# Altium project QN9080_PCB_Project.PrjPCB
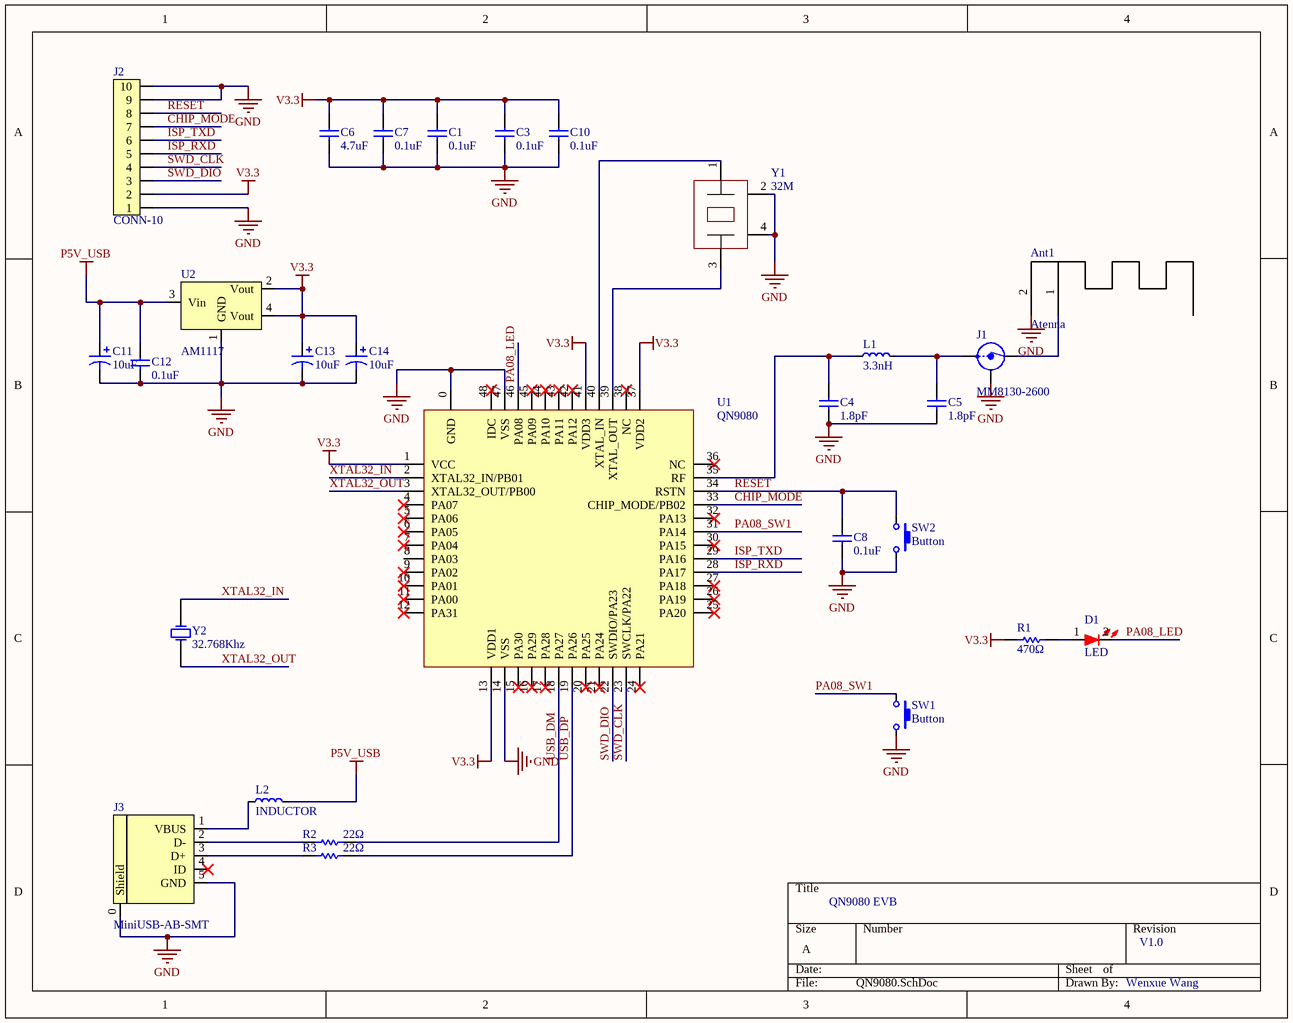
[diagram p0: QN9080.SchDoc]
1 sheet, 28 parts. Net scope: global (net labels, ports and power ports of the same name join across sheets).
Board file: QN9080.PcbDoc

## Sheet QN9080.SchDoc
size A

### Parts
Ant1  Atenna  [ANTENNA_IIFA_1]
C1  0.1uF  [RCL_0603]
C3  0.1uF  [RCL_0603]
C4  1.8pF  [RCL_0603]
C5  1.8pF  [RCL_0603]
C6  4.7uF  [RCL_0603]
C7  0.1uF  [RCL_0603]
C8  0.1uF  [RCL_0603]
C10  0.1uF  [RCL_0603]
C11  10uF  [RCL_0805]
C12  0.1uF  [RCL_0603]
C13  10uF  [RCL_0805]
C14  10uF  [RCL_0805]
D1  LED  [LED_0603]
J1  MM8130-2600  [COAXIAL-SWF]
J2  CONN-10  [HDR_1x10]
J3  MiniUSB-AB-SMT  [USB-Micro-B-RA-SMD-PiP]
L1  3.3nH  [RCL_0402]
L2  INDUCTOR  [RCL_0603]
R1  470Ω  [RCL_0603]
R2  22Ω  [RCL_0603]
R3  22Ω  [RCL_0603]
SW1  Button  [E-Switch]
SW2  Button  [E-Switch]
U1  QN9080  [QN9080QFN48pin]
U2  AM1117  [SOT-223]
Y1  32M  [BT-XTAL_2016]
Y2  32.768Khz  [XTAL32K_2012]

### Nets
GND: Ant1.2(GND) C1.1 C3.1 C4.1 C5.1 C6.1 C7.1 C8.1 C10.1 C11.2 C12.1 C13.2 C14.2 J1.2(Shield) J2.1 J2.9 J2.10 J3.0(Shield) J3.5(GND) SW1.2 SW2.2 U1.0(GND) U1.14(VSS) U1.47(VSS) U2.1(GND) Y1.2(GND) Y1.4(GND)
P5V_USB: C11.1 C12.2 L2.2 U2.3(Vin)
V3.3: C1.2 C3.2 C6.2 C7.2 C10.2 C13.1 C14.1 J2.2 R1.2 U1.1(VCC) U1.13(VDD1) U1.37(VDD2) U1.41(VDD3) U2.2(Vout) U2.4(Vout)
CHIP_MODE: J2.7 U1.33(CHIP_MODE/PB02)
ISP_RXD: J2.5 U1.28(PA17)
ISP_TXD: J2.6 U1.29(PA16)
PA08_LED: D1.2 U1.46(PA08)
PA08_SW1: SW1.1 U1.31(PA14)
RESET: C8.2 J2.8 SW2.1 U1.34(RSTN)
SWD_CLK: J2.4 U1.23(SWCLK/PA22)
SWD_DIO: J2.3 U1.22(SWDIO/PA23)
USB_DM: R2.1 U1.18(PA27)
USB_DP: R3.1 U1.19(PA26)
XTAL32_IN: U1.2(XTAL32_IN/PB01) Y2.2(OSC2)
XTAL32_OUT: U1.3(XTAL32_OUT/PB00) Y2.1(OSC1)
NetAnt1_1: Ant1.1(ANT) J1.3(OUT)
NetC4_2: C4.2 L1.1 U1.35(RF)
NetC5_2: C5.2 J1.1(IN) L1.2
NetD1_1: D1.1 R1.1
NetJ3_1: J3.1(VBUS) L2.1
NetJ3_2: J3.2(D-) R2.2
NetJ3_3: J3.3(D+) R3.2
NetU1_39: U1.39(XTAL_OUT) Y1.3(XTAL2)
NetU1_40: U1.40(XTAL_IN) Y1.1(XTAL1)

Not connected (* = marked no-connect by the designer): J3 4(ID)*; U1 4(PA07)* 5(PA06)* 6(PA05)* 7(PA04)* 8(PA03) 9(PA02)* 10(PA01)* 11(PA00)* 12(PA31)* 15(PA30)* 16(PA29)* 17(PA28)* 20(PA25)* 21(PA24)* 24(PA21)* 25(PA20)* 26(PA19)* 27(PA18)* 30(PA15)* 32(PA13)* 36(NC)* 38(NC)* 42(PA12)* 43(PA11)* 44(PA10)* 45(PA09)* 48(IDC)*

### Notes on the sheet
- QN9080 EVB
- V1.0
- Wenxue Wang

### Library data of the parts
C1 C3-C8 C10 C12 = C: Capacitor
C11 C13 C14 = CAP_Pol2
J1 = Coaxial-Internal-SW: Coaxial Connector with Switch; Value: MM8130-2600
J2 = CONN-10: Pin List 1x10, 2.54mm (100mil), SMD
J3 = MiniUSB-AB-SMT: MicroUSB-B-SMT
L1 = INDUCTOR
R1-R3 = Resitor
Y1 = Cystal_32Mhz
Y2 = Cystal_32Khz